# Altium schematic sheet Schematic_page2.SchDoc
size 420 x 297 mm; Address1: Address1; Address2: Address2; Address3: Address3; Address4: Address4; DocumentNumber: АБВГ.123456.001 Э3; SheetNumber: 1; Scale: 1:1; DocumentType: Схема электрическая принципиальная; FirstReferrence: АБВГ.123456.001
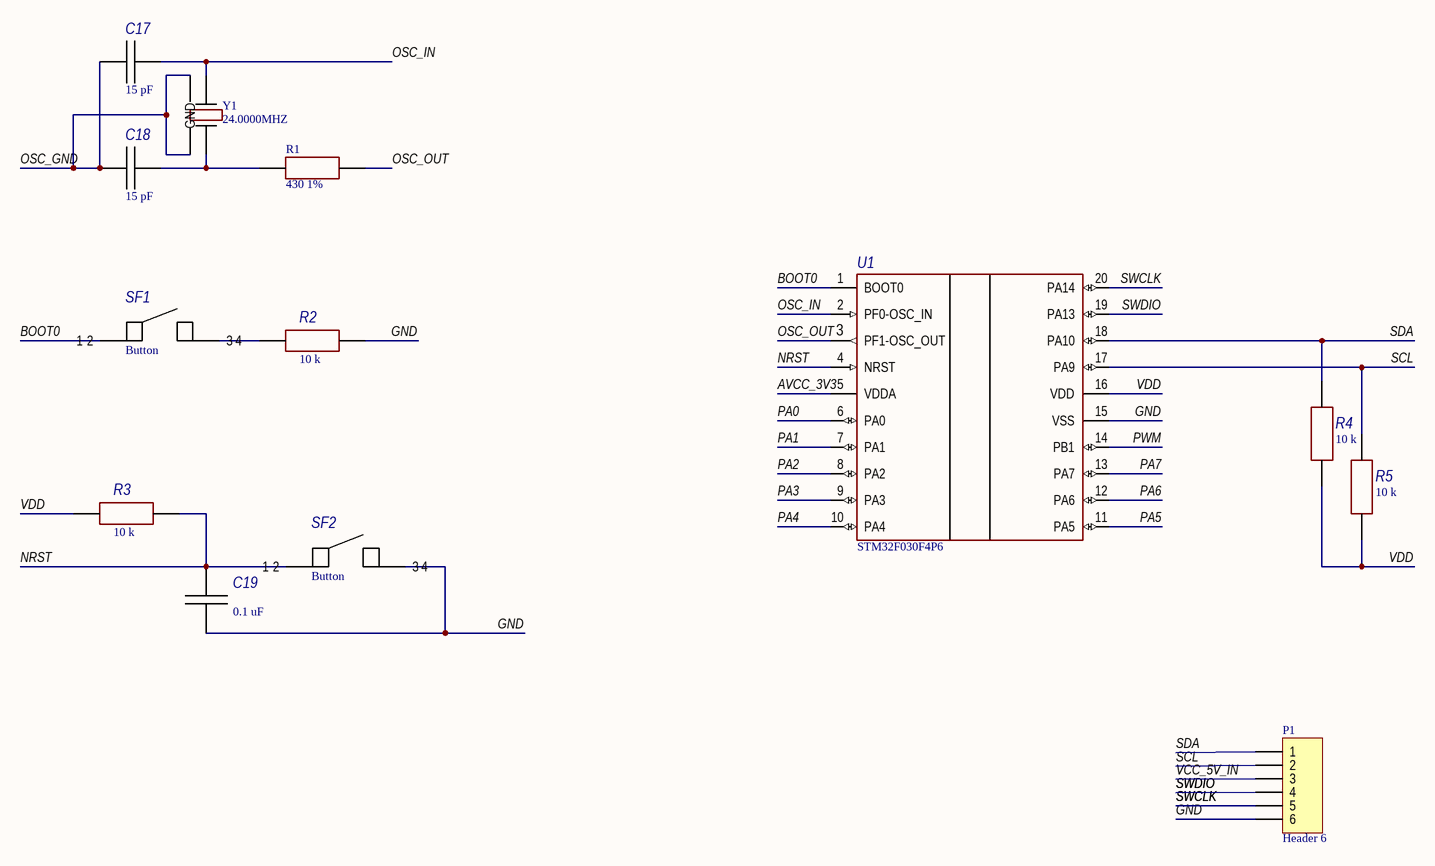
[diagram p0: Schematic_page2.SchDoc]

## Parts
C17  15 pF  [C0603]
C18  15 pF  [C0603]
C19  0.1 uF  [C0603]
P1  Header 6  [HDR1X6]
R1  430 1%  [R0603]
R2  10 k  [R0603]
R3  10 k  [R0603]
R4  10 k  [R0603]
R5  10 k  [R0603]
SF1  Button  [KMR221GLFS]
SF2  Button  [KMR221GLFS]
U1  STM32F030F4P6  [TSSOP-20]
Y1  24.0000MHZ  [TSX-3225]

## Nets
AVCC_3V3: U1.5(VDDA)
BOOT0: SF1.1 SF1.2 U1.1(BOOT0)
GND: C19.2 P1.6 R2.1 SF2.4 U1.15(VSS)
NRST: C19.1 R3.2 SF2.1 SF2.2 U1.4(NRST)
OSC_GND: C17.2 C18.2 Y1.2(GND) Y1.4(GND)
OSC_IN: C17.1 U1.2(PF0-OSC_IN) Y1.1
OSC_OUT: R1.2 U1.3(PF1-OSC_OUT)
PA0: U1.6(PA0)
PA1: U1.7(PA1)
PA2: U1.8(PA2)
PA3: U1.9(PA3)
PA4: U1.10(PA4)
PA5: U1.11(PA5)
PA6: U1.12(PA6)
PA7: U1.13(PA7)
PWM: U1.14(PB1)
SCL: P1.2 R5.2 U1.17(PA9)
SDA: P1.1 R4.2 U1.18(PA10)
SWCLK: P1.5 U1.20(PA14)
SWDIO: P1.4 U1.19(PA13)
VCC_5V_IN: P1.3
VDD: R3.1 R4.1 R5.1 U1.16(VDD)
NetC18_1: C18.1 R1.1 Y1.3
NetR2_2: R2.2 SF1.4

Not connected (* = marked no-connect by the designer): SF1 3; SF2 3

## Notes on the sheet
- Перв. примен.
- Справ. №
- Подп. и дата
- Инв. № дубл.
- Взам. инв. №
- Разраб.
- Изм.
- Лист
- № докум.
- Подп.
- Дата
- Лит.
- Масса
- Масштаб
- Пров.
- Т.контр.
- Листов
- Инв. № подл.
- Утв.
- Н.контр.
- 2.106-A3
- Копировал
- Формат А3

## Library data of the parts
C17 C18 = Capasitor: Manufacturer: Murata Manufacturing; Model: NP0 5% 100V; Value: 15 pF; Case: С0603; HelpURL: https://www.chipdip.by/product/grm1885c2a150j
C19 = Capasitor: Manufacturer: Murata Manufacturing; Model: X7R 10% 50V; Value: 0.1 uF; Case: С0603; HelpURL: https://www.chipdip.by/product/grm188r71h104k
P1 = Header 6: Header, 6-Pin; LatestRevisionDate: 17-Jul-2002; LatestRevisionNote: Re-released for DXP Platform.; Publisher: Altium Limited
R1 = Resistor: Rext.; Model: -; Value: 430 1%; HelpURL: https://www.chipdip.by/product0/9000079667; Case: R0603; Manufacturer: -
R2-R5 = Resistor: Manufacturer: YAGEO; Model: *; Value: 10 k; HelpURL: https://belchip.by/product/?selected_product=30985; Case: R0603
SF1 SF2 = Button: SWITCH TACTILE SPST-NO 0.05A 32V; Manufacturer: C&K; Model: KLS7-TS3401- 2,5-180(TVAF11); HelpURL: https://www.chipdip.by/product/kls7-ts3401-2-5-180-tvaf11; Case: KMR221GLFS
U1 = STM32F030F4P6: IC MCU 32BIT 16KB FLASH 20TSSOP; Manufacturer: STMicroelectronics; Model: STM32F030F4P6TR; Case: TSSOP-20; HelpURL: https://www.chipdip.by/product/stm32f030f4p6
Y1 = Crystal: CRYSTAL 24.0000MHZ 9PF SMD; Manufacturer: EPSON; Model: TSX-3225 24.0000MF20G-AC0; HelpURL: https://www.digikey.com/product-detail/en/epson/TSX-3225-24-0000MF20G-AC0/SER4185TR-ND/2819192; Case: TSX-3225; Value: 24.0000MHZ